# EAGLE design breakout (EAGLE 6.5.0)
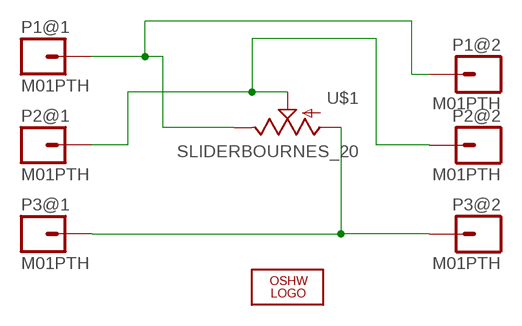
[diagram p0: schematic, sheet 1]

## Parts
LOGO1  OSHW_LOGO_FILLX0100-NT  [OSHW_FILLX100_NOTEXT]
P1@1  M01PTH  [1X01]
P1@2  M01PTH  [1X01]
P2@1  M01PTH  [1X01]
P2@2  M01PTH  [1X01]
P3@1  M01PTH  [1X01]
P3@2  M01PTH  [1X01]
U$1  SLIDERBOURNES_20  [BOURNS_20]

## Nets
N$2: P2@1.1 P2@2.1 U$1.P$2(S)
N$3: P3@1.1 P3@2.1 U$1.P$3(A)
N$4: P1@1.1 P1@2.1 U$1.P$1(E)

## Library data of the parts
LOGO1 = ohw-logo:OSHW_LOGO_FILL
P1@1 P1@2 P2@1 P2@2 P3@1 P3@2 = SparkFun-Connectors:M01: Header 1 Standard 1-pin 0.1" header. Use with straight break away headers (SKU : PRT-00116), right angle break away headers (PRT-00553), swiss pins (PRT-00743), machine pins (PRT-00117), and female headers (PRT-00115).
U$1 = Greg:SLIDER: Slide-type potentiometer- COM-9119

## Board
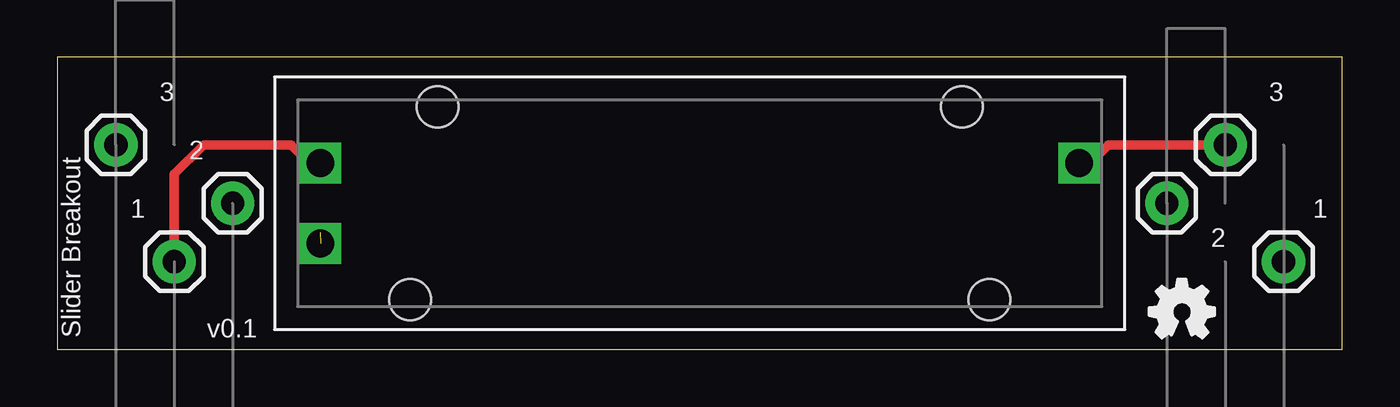
[diagram p1: board, top side]
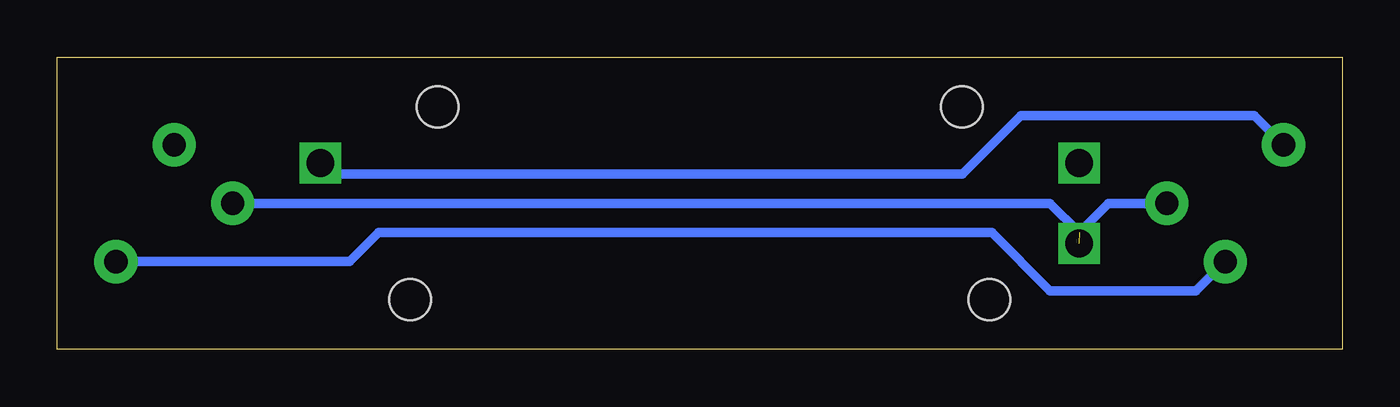
[diagram p2: board, bottom side, seen from below]

Size 55.88 x 12.7 mm. Coordinates in mm from the lower left corner, seen from the top.
Outline: 0,0 55.88,0 55.88,12.7 0,12.7 0,0
Copper layers (1*16): Top 0.0356mm / dielectric 1.5011mm / Bottom 0.0356mm
Design rules "LaenPCBOrder": minimum track width 6mil, minimum drill 13mil, track to track 6mil, track to pad 6mil, pad to pad 6mil, via to via 6mil, smd to smd 6mil, copper to edge 15mil, drill to drill 6mil, minimum pad ring 7mil, minimum via ring 7mil, stop-mask expansion 4mil, vias tented up to drill 0mil, thermal gap 10mil

### Footprints (pad centres in the part's own frame; a part is rotated, then mirrored left to right if it is on the bottom)
1X01 = drill 1.016 pad 1.88: 1 0,0
BOURNS_20 = drill 1.2 square: P$1 -16.5,1.75; P$2 -16.5,-1.75; P$3 16.5,1.75 | hole 1.8: -11.4,4.2; 11.4,4.2; -12.6,-4.2; 12.6,-4.2

### Placement (x,y rotation side)
LOGO1  47.5,0.5 0 top
P1@1  5.08,3.81 0 top
P1@2  53.34,3.81 0 top
P2@1  7.62,6.35 0 top
P2@2  48.26,6.35 0 top
P3@1  2.54,8.89 0 top
P3@2  50.8,8.89 0 top
U$1  27.94,6.35 0 top

### Tracks (layer width: path | path; a pad name or v marks a point on that pad's centre or on a via)
N$2  (1 unrouted)
  Bottom 0.406: P2@1.1 10.16,6.35 11.43,5.08 12.7,6.35 P2@2.1
N$3
  Top 0.406: U$1.P$3 44.93,8.1 45.72,8.89 P3@2.1
  Bottom 0.406: P3@1.1 3.81,10.16 13.97,10.16 16.51,7.62 43.96,7.62 U$1.P$3
N$4
  Top 0.406: U$1.P$1 10.95,8.1 10.16,8.89 6.35,8.89 5.08,7.62 P1@1.1
  Bottom 0.406: P1@1.1 6.35,2.54 12.7,2.54 15.24,5.08 41.91,5.08 43.18,3.81 P1@2.1

### Text on the board
tPlace: 3 | 3 | 2 | 1 | 1 | 2 | Slider Breakout | v0.1